# EAGLE schematic Uni-2,0,Complete (EAGLE 9.6.2)

## Sheet 1 of 4
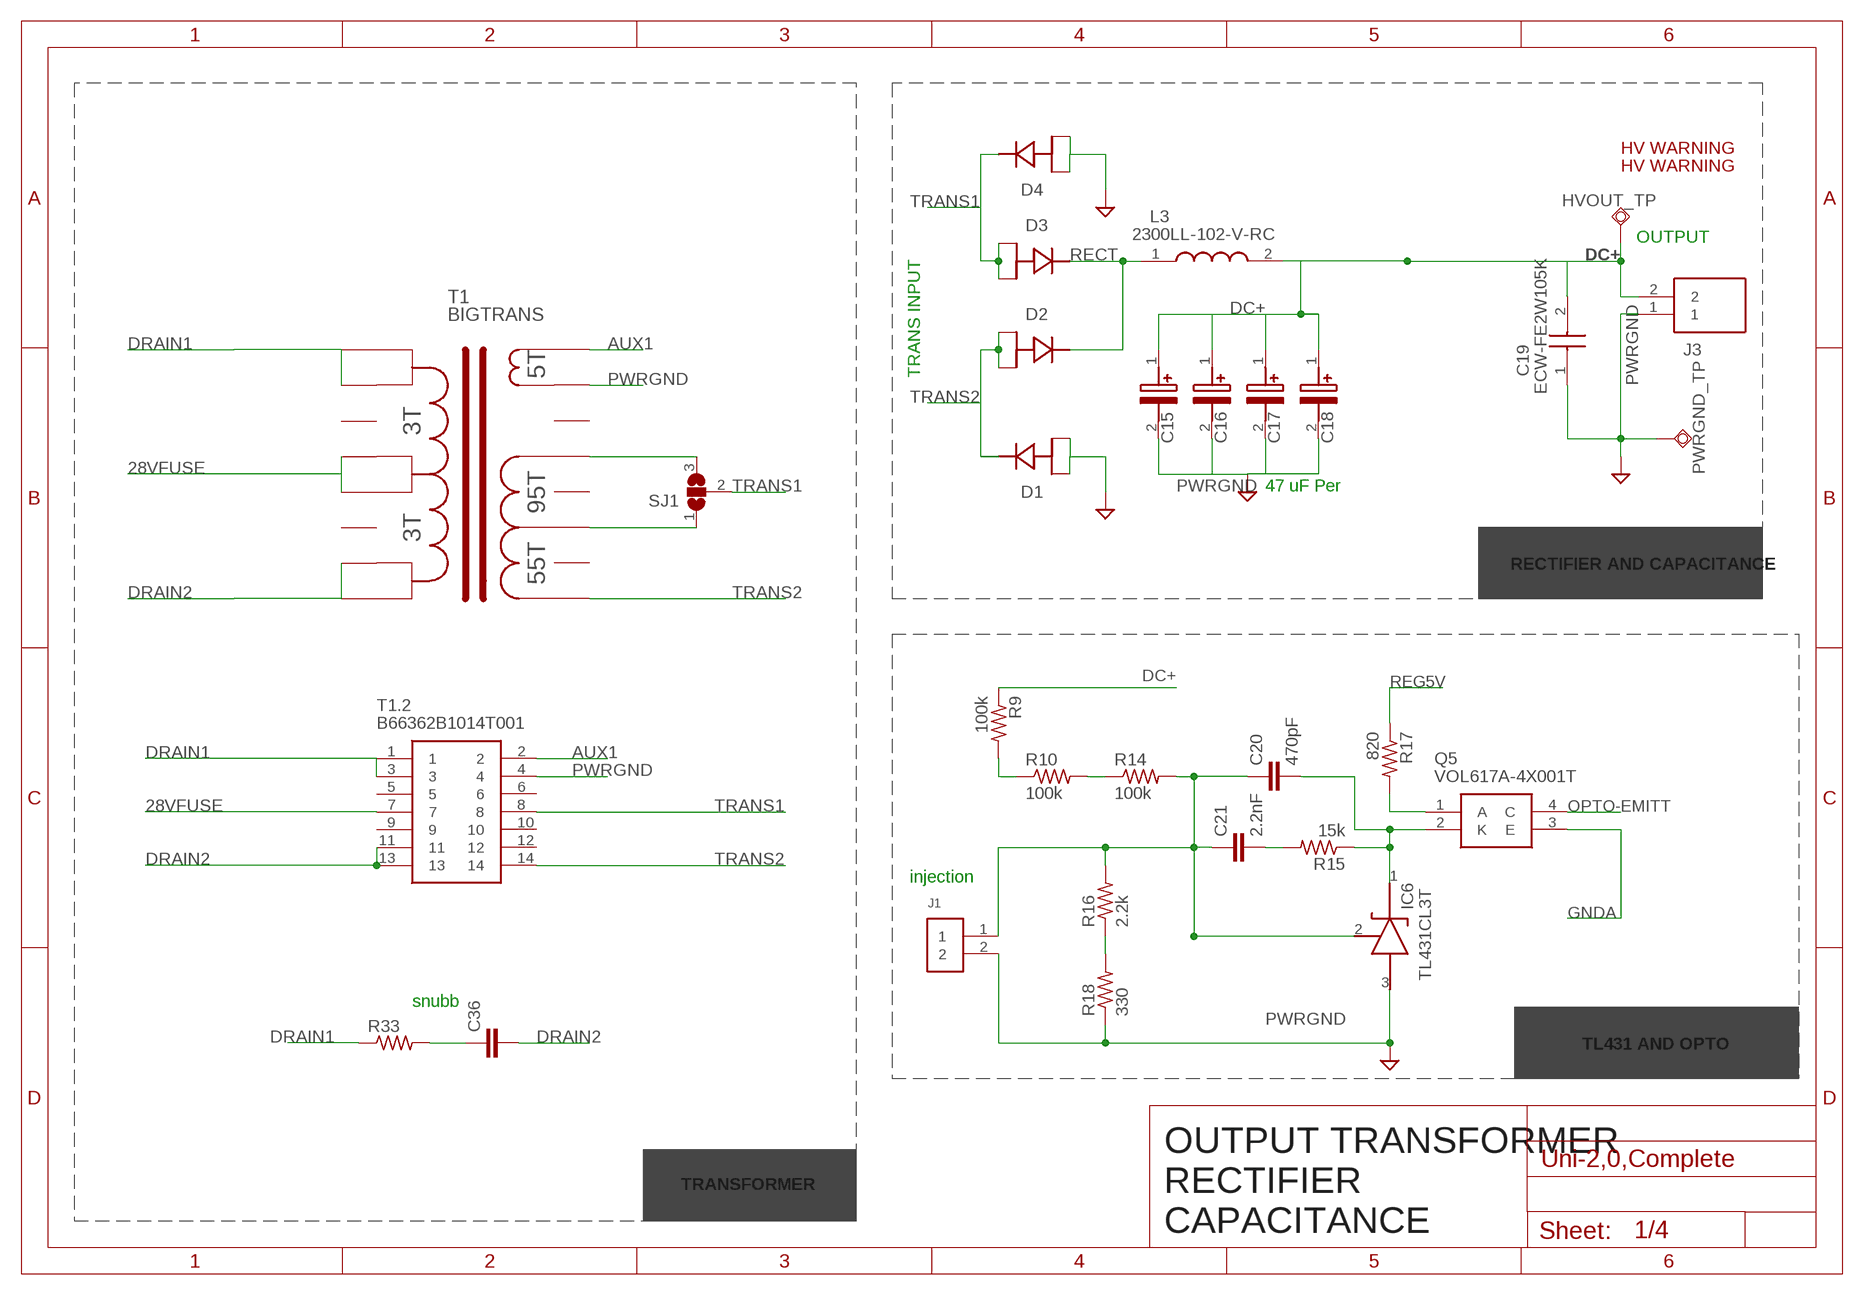
[diagram p0: schematic, sheet 1]

### Parts
C15  EEU-ED2V470S  [CAPPRD750W85D1800H2200]
C16  EEU-ED2V470S  [CAPPRD750W85D1800H2200]
C17  EEU-ED2V470S  [CAPPRD750W85D1800H2200]
C18  EEU-ED2V470S  [CAPPRD750W85D1800H2200]
C19  ECW-FE2W105K  [ECWFE2W105K]
C20  470pF  C-EUC0603K  [C0603K]
C21  2.2nF  C-EUC0603K  [C0603K]
C36  C-EUC1210K  [C1210K]
D1  FERD20H60CG-TR  [STB20N95K5]
D2  FERD20H60CG-TR  [STB20N95K5]
D3  FERD20H60CG-TR  [STB20N95K5]
D4  FERD20H60CG-TR  [STB20N95K5]
HVOUT_TP  TPSQPAD1-13  [P1-13]
IC6  TL431CL3T  [SOT95P237X112-3N]
J1  61300211121  [61300211121]
J3  TB005-762-02BE  [TB00576202BE]
L3  2300LL-102-V-RC  [2300LL102VRC]
PWRGND_TP  TPSQPAD1-13  [P1-13]
Q5  VOL617A-4X001T  [SOP254P1015X230-4N]
R9  100k  R-US_R1206  [R1206]
R10  100k  R-US_R1206  [R1206]
R14  100k  R-US_R1206  [R1206]
R15  15k  R-US_R0603  [R0603]
R16  2.2k  R-US_R0805  [R0805]
R17  820  R-US_R0603  [R0603]
R18  330  R-US_R0805  [R0805]
R33  R-US_R1206  [R1206]
SJ1  SJ2WW  [SJ_2W]
T1  BIGTRANS  [BIGTRANS!]
T1.2  B66362B1014T001  [B66362B1014T001]
U$2  HV  [PSFBC_ELECTRIC_SHOCK]
U$3  HV  [PSFBC_ELECTRIC_SHOCK]

### Nets
28VFUSE: T1.2.7 T1.4 T1.5 ; also sheet 3,4
AUX1: T1.2.2 T1.16 ; also sheet 3
DC+: C15.1(+) C16.1(+) C17.1(+) C18.1(+) C19.2 HVOUT_TP.TP J3.2 L3.2 R9.1 ; also sheet 2
DRAIN1: R33.1 T1.2.1 T1.2.3 T1.7 T1.8 ; also sheet 4
DRAIN2: C36.2 T1.1 T1.2 T1.2.11 T1.2.13 ; also sheet 4
GNDA: Q5.3(E) ; also sheet 3,4
N$1: R9.2 R10.1
N$3: C20.1 C21.1 IC6.2(REF) J1.1 R14.2 R16.2
N$9: SJ1.1 T1.11
N$15: R10.2 R14.1
N$16: R16.1 R18.2
N$18: C20.2 IC6.1(CATHODE) Q5.2(K) R15.1
N$19: Q5.1(A) R17.2
N$21: C21.2 R15.2
N$25: SJ1.3 T1.13
N$29: C36.1 R33.2
OPTO-EMITT: Q5.4(C) ; also sheet 4
PWRGND: C15.2(-) C16.2(-) C17.2(-) C18.2(-) C19.1 D1.1(A1) D1.3(A2) D4.1(A1) D4.3(A2) IC6.3(ANODE) J1.2 J3.1 PWRGND_TP.TP R18.1 T1.2.4 T1.15 ; supply symbol labelled GND ; also sheet 2,3
RECT: D2.2(K) D3.2(K) L3.1
REG5V: R17.1 ; also sheet 3
TRANS1: D3.1(A1) D3.3(A2) D4.2(K) SJ1.2 T1.2.8
TRANS2: D1.2(K) D2.1(A1) D2.3(A2) T1.2.14 T1.9
Unconnected: T1.2.5 T1.2.6 T1.2.9 T1.2.10 T1.2.12 T1.3 T1.6 T1.10 T1.12 T1.14

### Notes on the sheet
- OUTPUT
- TRANS INPUT
- 47 uF Per
- RECTIFIER AND CAPACITANCE
- injection
- snubb
- TL431 AND OPTO
- TRANSFORMER
- OUTPUT TRANSFORMER
  RECTIFIER
  CAPACITANCE

## Sheet 2 of 4
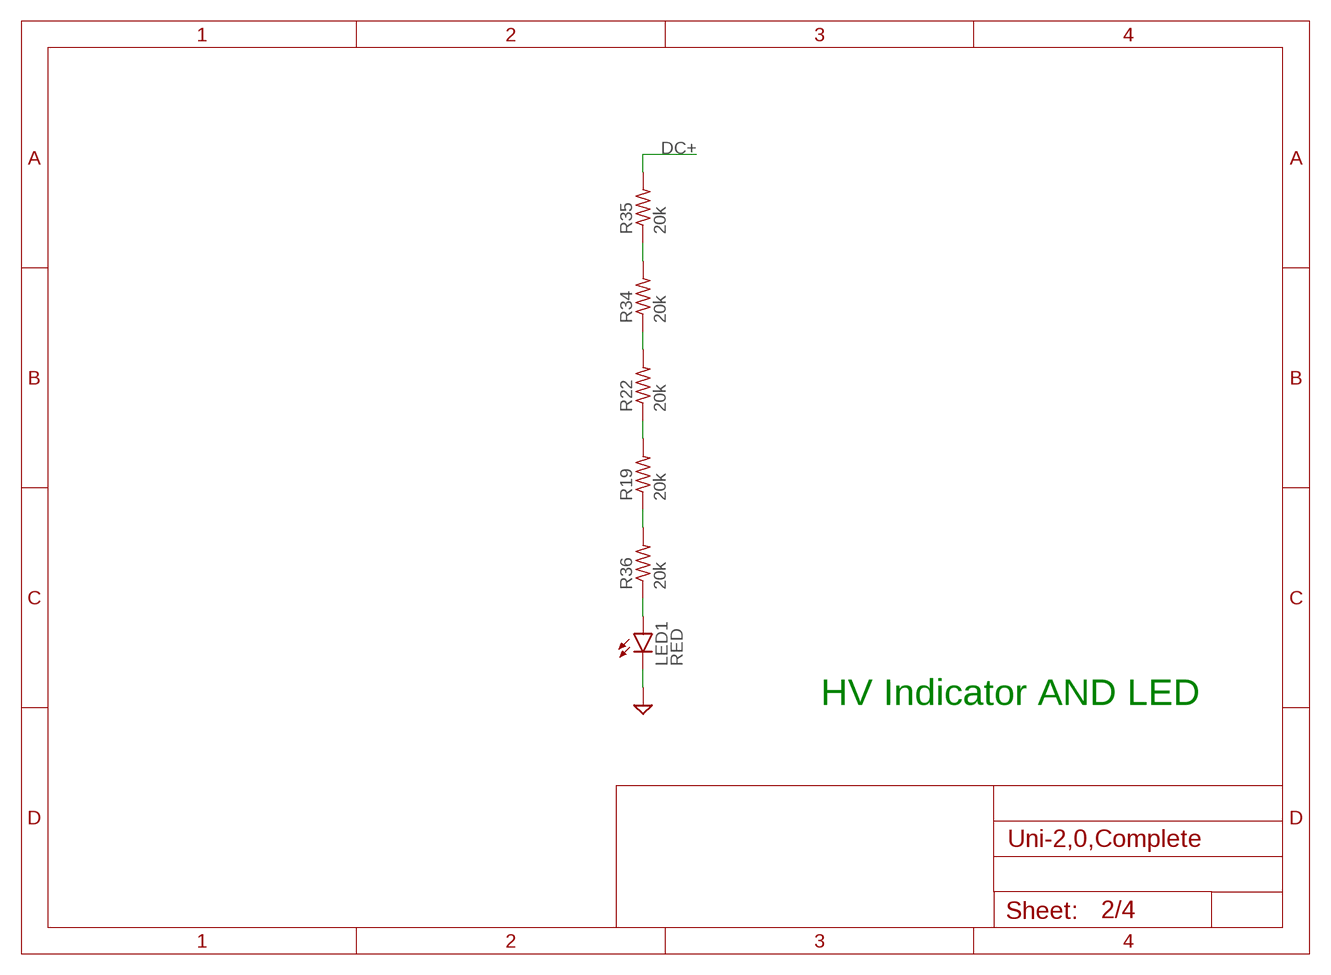
[diagram p1: schematic, sheet 2]

### Parts
LED1  RED  LEDCHIPLED_0805  [CHIPLED_0805]
R19  20k  R-US_R1206  [R1206]
R22  20k  R-US_R1206  [R1206]
R34  20k  R-US_R1206  [R1206]
R35  20k  R-US_R1206  [R1206]
R36  20k  R-US_R1206  [R1206]

### Nets
DC+: R35.2 ; also sheet 1
N$12: LED1.A R36.1
N$14: R19.1 R36.2
N$17: R19.2 R22.1
N$24: R22.2 R34.1
N$28: R34.2 R35.1
PWRGND: LED1.C ; supply symbol labelled GND ; also sheet 1,3

### Notes on the sheet
- HV Indicator AND LED

## Sheet 3 of 4
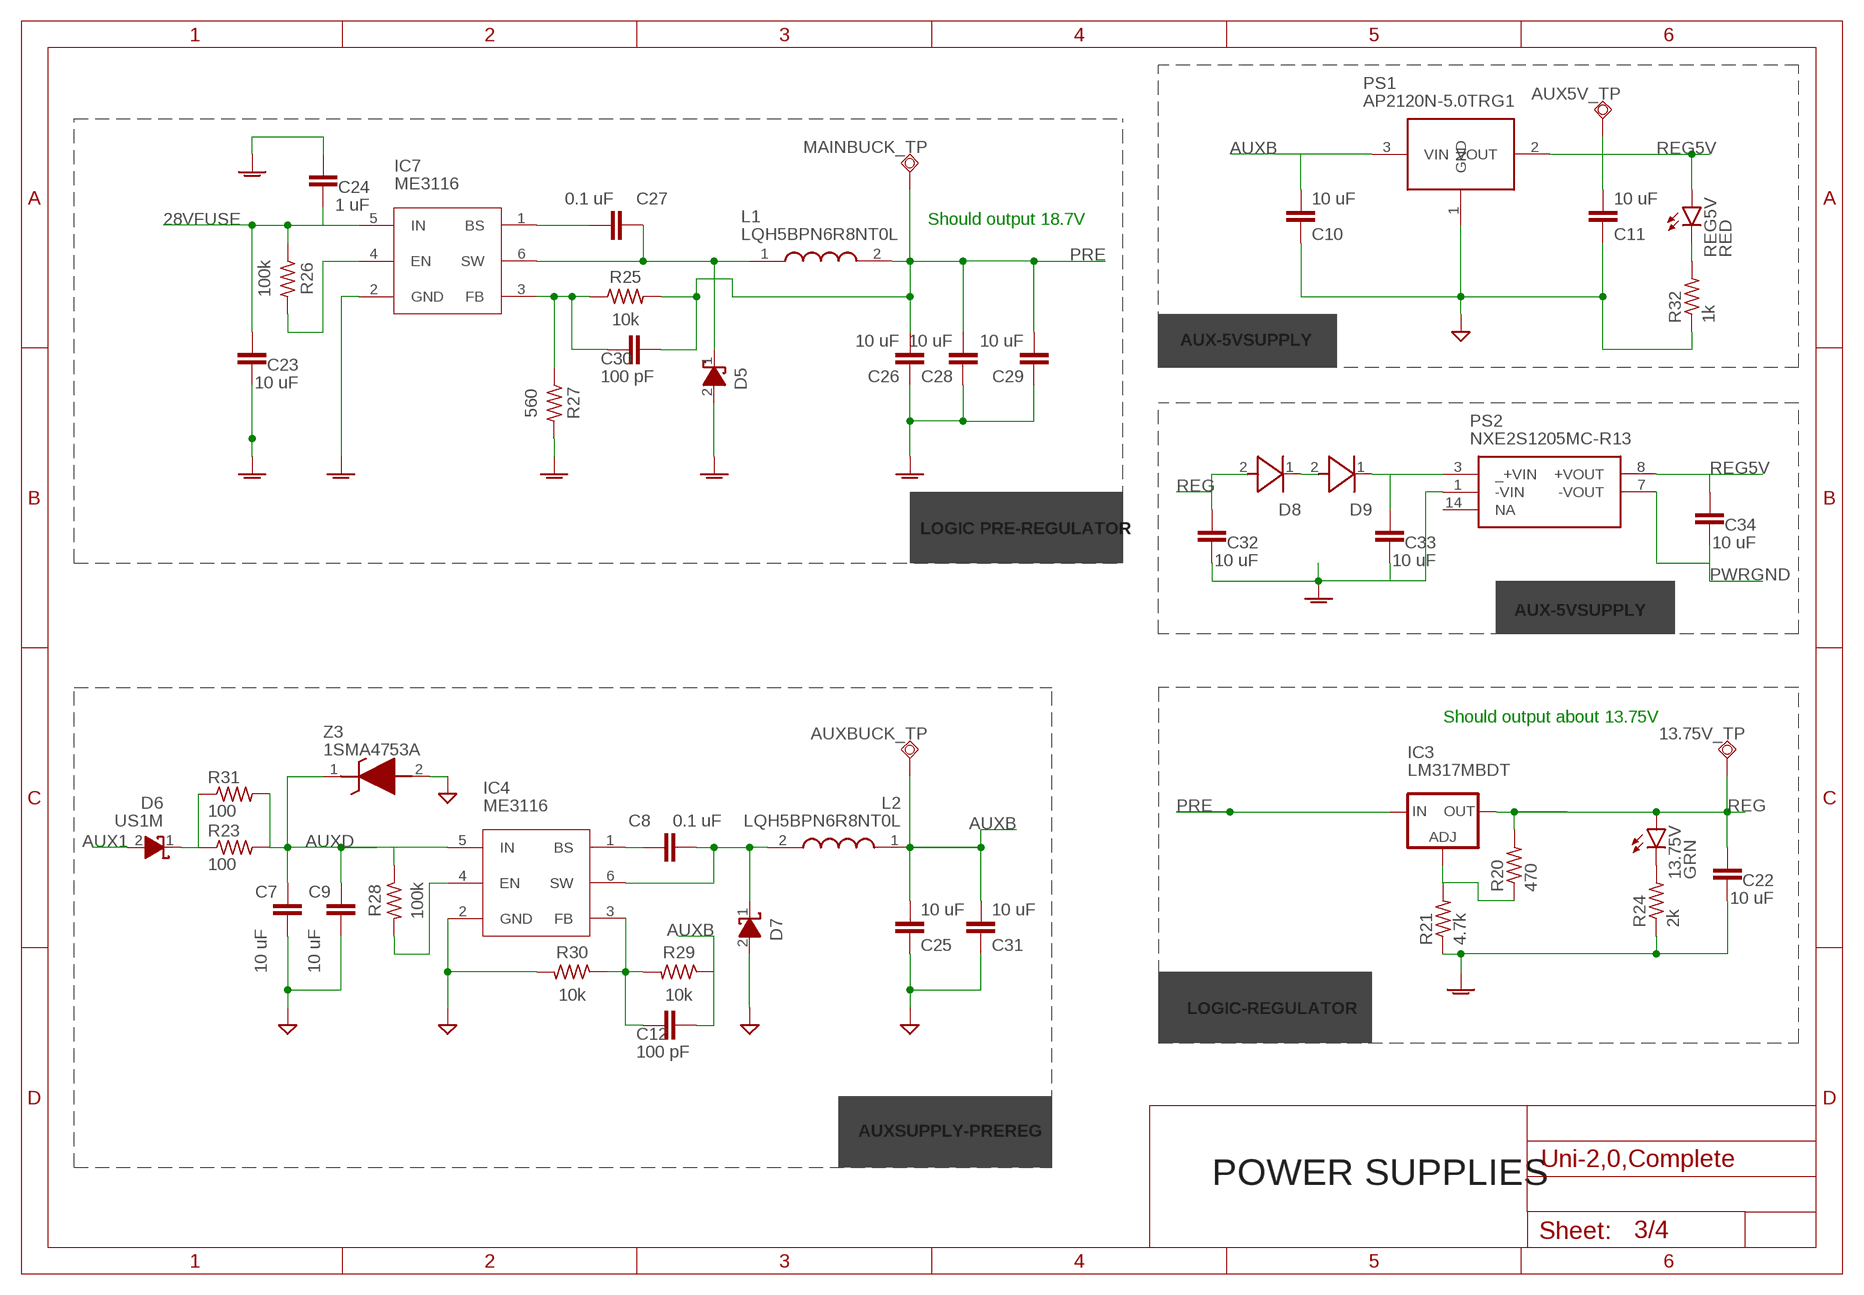
[diagram p2: schematic, sheet 3]

### Parts
13.75V  GRN  LEDCHIPLED_0805  [CHIPLED_0805]
13.75V_TP  TPSQPAD1-17  [P1-17]
AUX5V_TP  TPSQPAD1-17  [P1-17]
AUXBUCK_TP  TPSQPAD1-17  [P1-17]
C7  10 uF  C-EUC0805K  [C0805K]
C8  0.1 uF  C-EUC0603K  [C0603K]
C9  10 uF  C-EUC0805K  [C0805K]
C10  10 uF  C-EUC0603K  [C0603K]
C11  10 uF  C-EUC0603K  [C0603K]
C12  100 pF  C-EUC0402K  [C0402K]
C22  10 uF  C-EUC0805K  [C0805K]
C23  10 uF  C-EUC0805K  [C0805K]
C24  1 uF  C-EUC0603K  [C0603K]
C25  10 uF  C-EUC0603K  [C0603K]
C26  10 uF  C-EUC0805K  [C0805K]
C27  0.1 uF  C-EUC0603K  [C0603K]
C28  10 uF  C-EUC0805K  [C0805K]
C29  10 uF  C-EUC0805K  [C0805K]
C30  100 pF  C-EUC0402K  [C0402K]
C31  10 uF  C-EUC0402  [C0402]
C32  10 uF  C-EUC0805K  [C0805K]
C33  10 uF  C-EUC0603K  [C0603K]
C34  10 uF  C-EUC0603K  [C0603K]
D5  SCHOTTKY  [DIOM5127X229N]
D6  US1M  SCHOTTKY  [DIOM5127X229N]
D7  SCHOTTKY  [DIOM5127X229N]
D8  SM4007PL  1N4148W-7-F  [SOD3716X145N]
D9  SM4007PL  1N4148W-7-F  [SOD3716X145N]
IC3  LM317MBDT  [DPACK]
IC4  ME3116  [SOT95P280X100-6N]
IC7  ME3116  [SOT95P280X100-6N]
L1  LQH5BPN6R8NT0L  [LQH5BPB100MT0L]
L2  LQH5BPN6R8NT0L  [LQH5BPB100MT0L]
MAINBUCK_TP  TPSQPAD1-17  [P1-17]
PS1  AP2120N-5.0TRG1  [SOT95P240X120-3N]
PS2  NXE2S1205MC-R13  [NXE2S1205MCR13]
R20  470  R-US_R0603  [R0603]
R21  4.7k  R-US_R0603  [R0603]
R23  100  R-US_R1206  [R1206]
R24  2k  R-US_R0603  [R0603]
R25  10k  R-US_R0402  [R0402]
R26  100k  R-US_R0402  [R0402]
R27  560  R-US_R0402  [R0402]
R28  100k  R-US_R0402  [R0402]
R29  10k  R-US_R0402  [R0402]
R30  10k  R-US_R0402  [R0402]
R31  100  R-US_R1206  [R1206]
R32  1k  R-US_R0603  [R0603]
REG5V  RED  LEDCHIPLED_0805  [CHIPLED_0805]
Z3  1SMA4753A  1SMA5942BT3G  [DIOM5226X220N]

### Nets
28VFUSE: C23.2 C24.1 IC7.5(IN) R26.1 ; also sheet 1,4
AUX1: D6.2(A) ; also sheet 1
AUXB: AUXBUCK_TP.TP C10.2 C12.1 C25.2 C31.2 L2.1 PS1.3(VIN) R29.1
AUXD: C7.1 C9.1 IC4.5(IN) R23.2 R28.1 R31.2 Z3.1(K)
BS1: C27.2 IC7.1(BS)
BS2: C8.1 IC4.1(BS)
EN1: IC7.4(EN) R26.2
EN2: IC4.4(EN) R28.2
FB1: C30.2 IC7.3(FB) R25.1 R27.1
FB2: C12.2 IC4.3(FB) R29.2 R30.1
GNDA: C22.1 C23.1 C24.2 C26.1 C28.1 C29.1 C32.1 C33.1 D5.2(A) IC7.2(GND) PS2.1(-VIN) R21.1 R24.1 R27.2 ; also sheet 1,4
N$4: D8.1(K) D9.2(A)
N$10: IC3.1(ADJ) R20.1 R21.2
N$11: C33.2 D9.1(K) PS2.3(_+VIN)
N$22: 13.75V.C R24.2
N$26: R32.2 REG5V.C
N$27: D6.1(K) R23.1 R31.1
PRE: C26.2 C28.2 C29.2 C30.1 IC3.3(IN) L1.2 MAINBUCK_TP.TP R25.2
PWRGND: C7.2 C9.2 C10.1 C11.1 C25.1 C31.1 C34.1 D7.2(A) IC4.2(GND) PS1.1(GND) PS2.7(-VOUT) R30.2 R32.1 Z3.2(A) ; supply symbol labelled GND ; also sheet 1,2
REG: 13.75V.A 13.75V_TP.TP C22.2 C32.2 D8.2(A) IC3.4(OUT) R20.2 ; also sheet 4
REG5V: AUX5V_TP.TP C11.2 C34.2 PS1.2(VOUT) PS2.8(+VOUT) REG5V.A ; also sheet 1
SWITCH1: C27.1 D5.1(K) IC7.6(SW) L1.1
SWITCH2: C8.2 D7.1(K) IC4.6(SW) L2.2
Unconnected: PS2.14(NA)

### Notes on the sheet
- Should output 18.7V
- AUX-5VSUPPLY
- LOGIC PRE-REGULATOR
- AUX-5VSUPPLY
- Should output about 13.75V
- LOGIC-REGULATOR
- AUXSUPPLY-PREREG
- POWER SUPPLIES

## Sheet 4 of 4
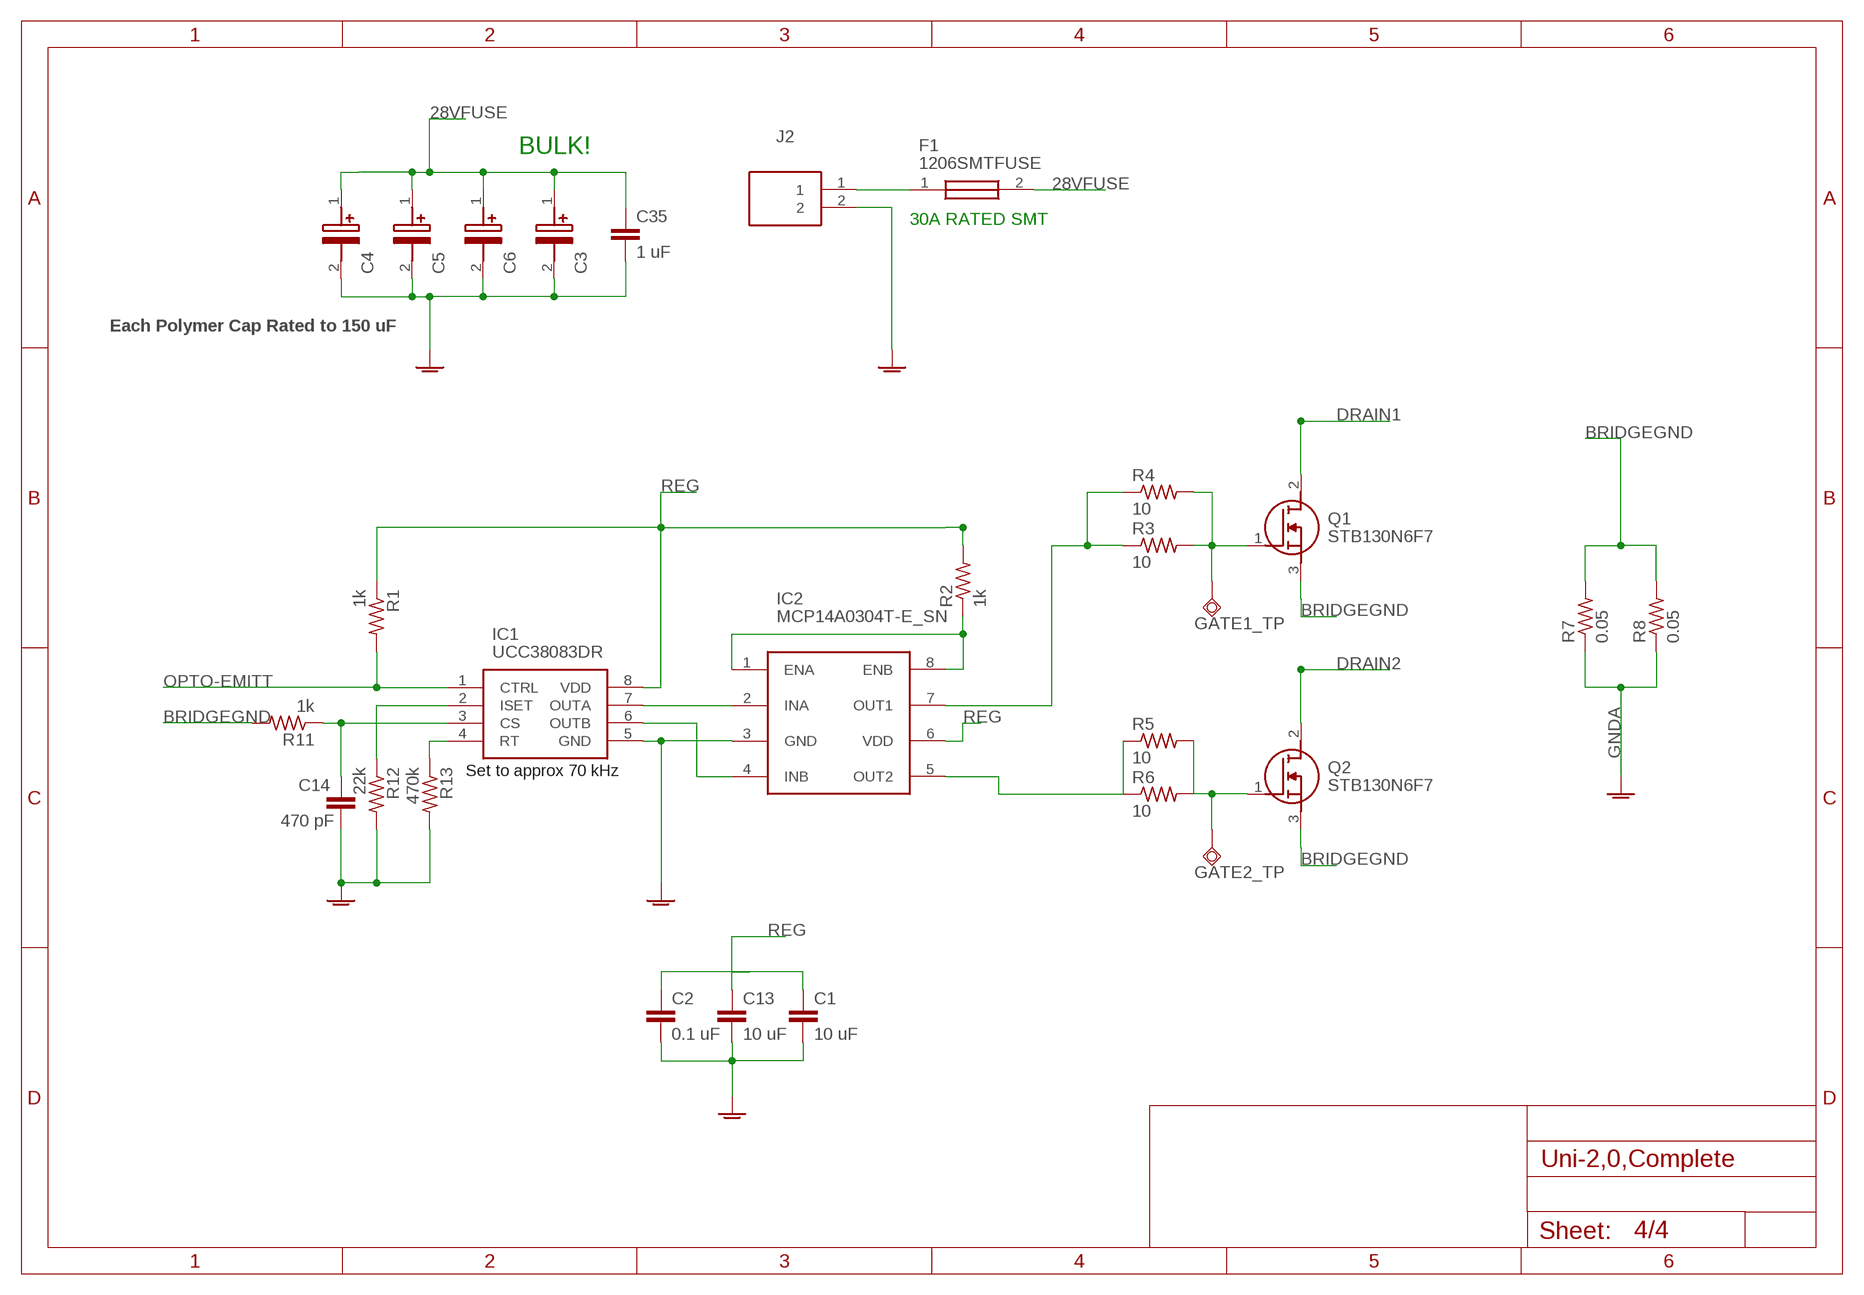
[diagram p3: schematic, sheet 4]

### Parts
C1  10 uF  C-EUC0603K  [C0603K]
C2  0.1 uF  C-EUC0603K  [C0603K]
C3  OVK151M1VTR-10131  [16SVF1000M]
C4  OVK151M1VTR-10131  [16SVF1000M]
C5  OVK151M1VTR-10131  [16SVF1000M]
C6  OVK151M1VTR-10131  [16SVF1000M]
C13  10 uF  C-EUC0603K  [C0603K]
C14  470 pF  C-EUC0603K  [C0603K]
C35  1 uF  C-EUC0805K  [C0805K]
F1  1206SMTFUSE  [1206SMTFUSE]
GATE1_TP  TPSQPAD1-17  [P1-17]
GATE2_TP  TPSQPAD1-17  [P1-17]
IC1  UCC38083DR  [SOIC127P600X175-8N]
IC2  MCP14A0304T-E_SN  [SOIC127P600X175-8N]
J2  TB005-762-02BE  [TB00576202BE]
Q1  STB130N6F7  [D2PAK]
Q2  STB130N6F7  [D2PAK]
R1  1k  R-US_R0603  [R0603]
R2  1k  R-US_R0402  [R0402]
R3  10  R-US_R0805  [R0805]
R4  10  R-US_R0805  [R0805]
R5  10  R-US_R0805  [R0805]
R6  10  R-US_R0805  [R0805]
R7  0.05  R-US_R2512  [R2512]
R8  0.05  R-US_R2512  [R2512]
R11  1k  R-US_R0603  [R0603]
R12  22k  R-US_R0603  [R0603]
R13  470k  R-US_R0603  [R0603]
U$1  HV  [PSFBC_ELECTRIC_SHOCK]  (not placed on a sheet)

### Nets
28VFUSE: C3.1(+) C4.1(+) C5.1(+) C6.1(+) C35.1 F1.2 ; also sheet 1,3
BRIDGEGND: Q1.3(S) Q2.3(S) R7.2 R8.2 R11.2
CS-IN: C14.1 IC1.3(CS) R11.1
DRAIN1: Q1.2(D) ; also sheet 1
DRAIN2: Q2.2(D) ; also sheet 1
GNDA: C1.2 C2.2 C3.2(-) C4.2(-) C5.2(-) C6.2(-) C13.2 C14.2 C35.2 IC1.5(GND) IC2.3(GND) J2.2 R7.1 R8.1 R12.2 R13.2 ; also sheet 1,3
N$2: IC1.7(OUTA) IC2.2(INA)
N$5: IC1.6(OUTB) IC2.4(INB)
N$6: IC2.1(ENA) IC2.8(ENB) R2.1
N$7: IC2.7(OUT1) R3.1 R4.1
N$8: IC2.5(OUT2) R5.1 R6.1
N$13: IC1.2(ISET) R12.1
N$20: F1.1 J2.1
OPTO-EMITT: IC1.1(CTRL) R1.2 ; also sheet 1
Q1G: GATE1_TP.TP Q1.1(G) R3.2 R4.2
Q2G: GATE2_TP.TP Q2.1(G) R5.2 R6.2
REG: C1.1 C2.1 C13.1 IC1.8(VDD) IC2.6(VDD) R1.1 R2.2 ; also sheet 3
RT: IC1.4(RT) R13.1

### Notes on the sheet
- BULK!
- 30A RATED SMT
- Each Polymer Cap Rated to 150 uF
- Set to approx 70 kHz

## Library data of the parts
13.75V REG5V = led:LED: LED OSRAM: - CHIPLED LG R971, LG N971, LY N971, LG Q971, LY Q971, LO R971, LY R971 LH N974, LH R974 LS Q976, LO Q976, LY Q976 LO Q996 - Hyper CHIPLED LW Q18S LB Q993, LB Q99A, LB R99A - SideLED LS A670, LO A670, LY A670, LG A670, LP A670 LB A673, LV A673, LT A673, LW A673 LH A674 LY A675 LS A676, LA A676, LO A676, LY A676, LW A676 LS A679, LY A679, LG A679 - Hyper Micro SIDELED® LS Y876, LA Y876, LO Y876, LY Y876 LT Y87S - SmartLED LW L88C, LW L88S LB L89C, LB L89S, LG L890 LS L89K, LO L89K, LY L89K LS L896, LA L896, LO L896, LY L896 - TOPLED LS T670, LO T670, LY T670, LG T670, LP T670 LSG T670, LSP T670, LSY T670, LOP T670, LYG T670 LG T671, LOG T671, LSG T671 LB T673, LV T673, LT T673, LW T673 LH T674 LS T676, LA T676, LO T676, LY T676, LB T676, LH T676, LSB T676, LW T676 LB T67C, LV T67C, LT T67C, LS T67K, LO T67K, LY T67K, LW E67C LS E67B, LA E67B, LO E67B, LY E67B, LB E67C, LV E67C, LT E67C LW T67C LS T679, LY T679, LG T679 LS T770, LO T770, LY T770, LG T770, LP T770 LB T773, LV T773, LT T773, LW T773 LH T774 LS E675, LA E675, LY E675, LS T675 LS T776, LA T776, LO T776, LY T776, LB T776 LHGB T686 LT T68C, LB T68C - Hyper Mini TOPLED® LB M676 - Mini TOPLED Santana® LG M470 LS M47K, LO M47K, LY M47K Source: http://www.osram.convergy.de LUXEON: - LUMILED® LXK2-PW12-R00, LXK2-PW12-S00, LXK2-PW14-U00, LXK2-PW14-V00 LXK2-PM12-R00, LXK2-PM12-S00, LXK2-PM14-U00 LXK2-PE12-Q00, LXK2-PE12-R00, LXK2-PE12-S00, LXK2-PE14-T00, LXK2-PE14-U00 LXK2-PB12-K00, LXK2-PB12-L00, LXK2-PB12-M00, LXK2-PB14-N00, LXK2-PB14-P00, LXK2-PB14-Q00 LXK2-PR12-L00, LXK2-PR12-M00, LXK2-PR14-Q00, LXK2-PR14-R00 LXK2-PD12-Q00, LXK2-PD12-R00, LXK2-PD12-S00 LXK2-PH12-R00, LXK2-PH12-S00 LXK2-PL12-P00, LXK2-PL12-Q00, LXK2-PL12-R00 Source: www.luxeon.com KINGBRIGHT: KA-3528ASYC Source: www.kingbright.com; LCSC_PART: C72043
13.75V_TP AUX5V_TP AUXBUCK_TP GATE1_TP GATE2_TP HVOUT_TP MAINBUCK_TP PWRGND_TP = testpad:TPSQ: Test pad
C1 C2 C10 C13 C24 C25 C31 C33-C35 = rcl:C-EU: CAPACITOR, European symbol; LCSC_PART: C440198; SPICEPREFIX: C
C3-C6 = SamacSys_Parts:OVK151M1VTR-1013: OVK151M1VTR-1013
C7 C9 C11 C20 C21 C36 = rcl:C-EU: CAPACITOR, European symbol; SPICEPREFIX: C
C8 C27 = rcl:C-EU: CAPACITOR, European symbol; LCSC_PART: C14663; SPICEPREFIX: C
C12 C30 = rcl:C-EU: CAPACITOR, European symbol; LCSC_PART: C1546; SPICEPREFIX: C
C14 = rcl:C-EU: CAPACITOR, European symbol; LCSC_PART: C1620; SPICEPREFIX: C
C15-C18 = SamacSys_Parts:EEU-ED2V470S: Aluminium Electrolytic Capacitor, Radial Lead Source: Datasheet <http://industrial.panasonic.com/cdbs/www-data/pdf/RDF0000/ABA0000C1258.pdf>; DESCRIPTION: Aluminium Electrolytic Capacitor, Radial Lead; HEIGHT: 22mm; MANUFACTURER_NAME: Panasonic; MANUFACTURER_PART_NUMBER: EEU-ED2V470S; MOUSER_PART_NUMBER: 667-EEU-ED2V470S; MOUSER_PRICE-STOCK: https://www.mouser.co.uk/ProductDetail/Panasonic/EEU-ED2V470S?qs=MtOUKumLmnbbtLZIfgoN%2Fg%3D%3D
C19 = SamacSys_Parts:ECW-FE2W105K: Film Capacitors 450VDC 1.0uF 10% MPP L/S=15mm Source: Datasheet <https://www.mouser.fr/datasheet/2/315/panasonic_06262019_Capacitor_Film_Leaded_(ECW-F(E)-1609057.pdf>; DESCRIPTION: Film Capacitors 450VDC 1.0uF 10% MPP L/S=15mm; HEIGHT: 13mm; MANUFACTURER_NAME: Panasonic; MANUFACTURER_PART_NUMBER: ECW-FE2W105K
C22 C23 C26 C28 C29 C32 = rcl:C-EU: CAPACITOR, European symbol; LCSC_PART: C440198
D1-D4 = SamacSys_Parts:FERD20H60CG-TR: Rectifiers Field-Effect Rectifier Diode 60V Source: Datasheet <https://www.st.com/resource/en/datasheet/ferd20h60c.pdf>; DESCRIPTION: Rectifiers Field-Effect Rectifier Diode 60V; HEIGHT: 4mm; MANUFACTURER_NAME: STMicroelectronics; MANUFACTURER_PART_NUMBER: FERD20H60CG-TR; MOUSER_PART_NUMBER: 511-FERD20H60CG-TR; MOUSER_PRICE-STOCK: https://www.mouser.co.uk/ProductDetail/STMicroelectronics/FERD20H60CG-TR?qs=1mbolxNpo8ebHpKodyoUCQ%3D%3D
D5 D7 = SamacSys_Parts:SCHOTTKY: Schottky Diodes & Rectifiers 60V Sctky Bar Rectfr SMA (DO-214AC) Source: Datasheet <https://www.arrow.com/en/products/ss16he3-bh/vishay>; DESCRIPTION: Schottky Diodes & Rectifiers 60V Sctky Bar Rectfr SMA (DO-214AC); HEIGHT: 2.29mm; LCSC_PART: C22452; MANUFACTURER_NAME: Vishay; MANUFACTURER_PART_NUMBER: SS16HE3_B/H; MOUSER_PART_NUMBER: 78-SS16HE3_B/H; MOUSER_PRICE-STOCK: https://www.mouser.co.uk/ProductDetail/Vishay-General-Semiconductor/SS16HE3_B-H?qs=MLItCLRbWsyJmaJ87KUvIw%3D%3D
D6 = SamacSys_Parts:SCHOTTKY: Schottky Diodes & Rectifiers 60V Sctky Bar Rectfr SMA (DO-214AC) Source: Datasheet <https://www.arrow.com/en/products/ss16he3-bh/vishay>; DESCRIPTION: Schottky Diodes & Rectifiers 60V Sctky Bar Rectfr SMA (DO-214AC); HEIGHT: 2.29mm; MANUFACTURER_NAME: Vishay; MANUFACTURER_PART_NUMBER: SS16HE3_B/H; MOUSER_PART_NUMBER: 78-SS16HE3_B/H; MOUSER_PRICE-STOCK: https://www.mouser.co.uk/ProductDetail/Vishay-General-Semiconductor/SS16HE3_B-H?qs=MLItCLRbWsyJmaJ87KUvIw%3D%3D
D8 D9 = SamacSys_Parts:1N4148W-7-F: Diode Switching 150mA 100V 400mW SOD123 Diodes Inc 1N4148W-7-F Switching Diode 100V, 2-Pin SOD-123 Source: Datasheet <https://componentsearchengine.com/Datasheets/2/1N4148W-7-F.pdf>; DESCRIPTION: Diode Switching 150mA 100V 400mW SOD123 Diodes Inc 1N4148W-7-F Switching Diode 100V, 2-Pin SOD-123; HEIGHT: 1.45mm; LCSC_PART: C64898; MANUFACTURER_NAME: Diodes Inc.; MANUFACTURER_PART_NUMBER: 1N4148W-7-F; MOUSER_PART_NUMBER: 621-1N4148W-F; MOUSER_PRICE-STOCK: https://www.mouser.co.uk/ProductDetail/Diodes-Incorporated/1N4148W-7-F?qs=LHX0FizJzg7Ae9ZM8LTAWw%3D%3D
F1 = SamacSys_Parts:1206SMTFUSE: Surface Mount Fuses Surface Mt Chip fuse 1206 size, 40A Source: Datasheet <https://www.belfuse.com/resources/datasheets/circuitprotection/ds-cp-0685p-series.pdf>; DESCRIPTION: Surface Mount Fuses Surface Mt Chip fuse 1206 size, 40A; HEIGHT: 0.83mm; MANUFACTURER_NAME: Stewart Connector; MANUFACTURER_PART_NUMBER: 0685P9400-01; MOUSER_PART_NUMBER: 530-0685P9400-01; MOUSER_PRICE-STOCK: https://www.mouser.co.uk/ProductDetail/Bel-Fuse/0685P9400-01?qs=vLWxofP3U2w%252BWbEEn77VXg%3D%3D
IC1 = SamacSys_Parts:UCC38083DR: Current Mode Push-Pull PWM With Programmable Slope Compensation Source: Datasheet <http://www.ti.com/lit/gpn/ucc38083>; DESCRIPTION: Current Mode Push-Pull PWM With Programmable Slope Compensation; HEIGHT: 1.75mm; MANUFACTURER_NAME: Texas Instruments; MANUFACTURER_PART_NUMBER: UCC38083DR; MOUSER_PART_NUMBER: 595-UCC38083DR; MOUSER_PRICE-STOCK: https://www.mouser.co.uk/ProductDetail/Texas-Instruments/UCC38083DR/?qs=zqbRmZ%252BfZD9Rvt3ie7yhvg%3D%3D
IC2 = SamacSys_Parts:MCP14A0304T-E_SN: Microchip Technology MCP14A0304T-E/SN Dual Low Side MOSFET Power Driver, 3A 8-Pin, SOIC Source: Datasheet <http://www.microchip.com/mymicrochip/filehandler.aspx?ddocname=en606629>; DESCRIPTION: Microchip Technology MCP14A0304T-E/SN Dual Low Side MOSFET Power Driver, 3A 8-Pin, SOIC; HEIGHT: 1.75mm; MANUFACTURER_NAME: Microchip; MANUFACTURER_PART_NUMBER: MCP14A0304T-E/SN; MOUSER_PART_NUMBER: 579-MCP14A0304T-E/SN; MOUSER_PRICE-STOCK: https://www.mouser.co.uk/ProductDetail/Microchip-Technology/MCP14A0304T-E-SN?qs=w%2Fv1CP2dgqqqWUCaoFqV0w%3D%3D
IC3 = v-reg:LM317?*: 500 mA Adjustable Output Positive Voltage Regulator Source: http://www.onsemi.co.jp .. LM317M-D.PDF
IC4 IC7 = SamacSys_Parts:ME3116; LCSC_PART: C97643
IC6 = SamacSys_Parts:TL431CL3T: Adjustable micropower shunt voltage reference Source: Datasheet <https://www.st.com/resource/en/datasheet/tl431.pdf>; DESCRIPTION: Adjustable micropower shunt voltage reference; HEIGHT: 1.12mm; MANUFACTURER_NAME: STMicroelectronics; MANUFACTURER_PART_NUMBER: TL431CL3T; MOUSER_PART_NUMBER: 511-TL431CL3T; MOUSER_PRICE-STOCK: https://www.mouser.co.uk/ProductDetail/STMicroelectronics/TL431CL3T?qs=L6eUzyzWLAsU2SYO1NdhdA%3D%3D
J1 = Headers:61300211121: CONN HEADER VERT 2POS 2.54MM Manufacturer's datasheet <https://katalog.we-online.de/em/datasheet/6130xx11121.pdf>; CREATED_BY: PCBLayout.com; DIGI_KEY_PART_NUMBER: 732-5315-ND; MANUFACTURER: Wurth Electronics Inc.; MPN: 61300211121
J2 J3 = SamacSys_Parts:TB005-762-02BE: Fixed Terminal Blocks screw type, 7.62 , horizontal, 2 poles, CUI Blue, slotted screw, PCB mount Source: Datasheet <https://componentsearchengine.com/Datasheets/1/TB005-762-02BE.pdf>; DESCRIPTION: Fixed Terminal Blocks screw type, 7.62 , horizontal, 2 poles, CUI Blue, slotted screw, PCB mount; HEIGHT: 21.7mm; MANUFACTURER_NAME: CUI Inc.; MANUFACTURER_PART_NUMBER: TB005-762-02BE; MOUSER_PART_NUMBER: 490-TB005-762-02BE; MOUSER_PRICE-STOCK: https://www.mouser.co.uk/ProductDetail/CUI-Devices/TB005-762-02BE?qs=vLWxofP3U2zXv1H2wuShow%3D%3D
L1 L2 = SamacSys_Parts:LQH5BPN6R8NT0L: MURATA - LQH5BPN6R8NT0L - INDUCTOR, 6.8UH, +/-30%, POWER Source: Datasheet <https://psearch.en.murata.com/inductor/product/LQH5BPN6R8NT0#.html>; DESCRIPTION: MURATA - LQH5BPN6R8NT0L - INDUCTOR, 6.8UH, +/-30%, POWER; HEIGHT: 2.2mm; MANUFACTURER_NAME: Murata Electronics; MANUFACTURER_PART_NUMBER: LQH5BPN6R8NT0L; MOUSER_PART_NUMBER: 81-LQH5BPN6R8NT0L0L; MOUSER_PRICE-STOCK: https://www.mouser.co.uk/ProductDetail/Murata-Electronics/LQH5BPN6R8NT0L?qs=3ZwS9AhGA%2F4N8axqd87eRQ%3D%3D
L3 = SamacSys_Parts:2300LL-102-V-RC: Inductor High Current Toroid 1000uH/378.9uH 15% 1KHz 3.5A 137mOhm DCR RDL Source: Datasheet; DESCRIPTION: Inductor High Current Toroid 1000uH/378.9uH 15% 1KHz 3.5A 137mOhm DCR RDL; HEIGHT: 32.512mm; MANUFACTURER_NAME: Bourns; MANUFACTURER_PART_NUMBER: 2300LL-102-V-RC; MOUSER_PART_NUMBER: 652-2300LL-102-V-RC; MOUSER_PRICE-STOCK: https://www.mouser.co.uk/ProductDetail/Bourns/2300LL-102-V-RC?qs=d7g9p1yFhWZHzfawXthNnQ%3D%3D
LED1 = led:LED: LED OSRAM: - CHIPLED LG R971, LG N971, LY N971, LG Q971, LY Q971, LO R971, LY R971 LH N974, LH R974 LS Q976, LO Q976, LY Q976 LO Q996 - Hyper CHIPLED LW Q18S LB Q993, LB Q99A, LB R99A - SideLED LS A670, LO A670, LY A670, LG A670, LP A670 LB A673, LV A673, LT A673, LW A673 LH A674 LY A675 LS A676, LA A676, LO A676, LY A676, LW A676 LS A679, LY A679, LG A679 - Hyper Micro SIDELED® LS Y876, LA Y876, LO Y876, LY Y876 LT Y87S - SmartLED LW L88C, LW L88S LB L89C, LB L89S, LG L890 LS L89K, LO L89K, LY L89K LS L896, LA L896, LO L896, LY L896 - TOPLED LS T670, LO T670, LY T670, LG T670, LP T670 LSG T670, LSP T670, LSY T670, LOP T670, LYG T670 LG T671, LOG T671, LSG T671 LB T673, LV T673, LT T673, LW T673 LH T674 LS T676, LA T676, LO T676, LY T676, LB T676, LH T676, LSB T676, LW T676 LB T67C, LV T67C, LT T67C, LS T67K, LO T67K, LY T67K, LW E67C LS E67B, LA E67B, LO E67B, LY E67B, LB E67C, LV E67C, LT E67C LW T67C LS T679, LY T679, LG T679 LS T770, LO T770, LY T770, LG T770, LP T770 LB T773, LV T773, LT T773, LW T773 LH T774 LS E675, LA E675, LY E675, LS T675 LS T776, LA T776, LO T776, LY T776, LB T776 LHGB T686 LT T68C, LB T68C - Hyper Mini TOPLED® LB M676 - Mini TOPLED Santana® LG M470 LS M47K, LO M47K, LY M47K Source: http://www.osram.convergy.de LUXEON: - LUMILED® LXK2-PW12-R00, LXK2-PW12-S00, LXK2-PW14-U00, LXK2-PW14-V00 LXK2-PM12-R00, LXK2-PM12-S00, LXK2-PM14-U00 LXK2-PE12-Q00, LXK2-PE12-R00, LXK2-PE12-S00, LXK2-PE14-T00, LXK2-PE14-U00 LXK2-PB12-K00, LXK2-PB12-L00, LXK2-PB12-M00, LXK2-PB14-N00, LXK2-PB14-P00, LXK2-PB14-Q00 LXK2-PR12-L00, LXK2-PR12-M00, LXK2-PR14-Q00, LXK2-PR14-R00 LXK2-PD12-Q00, LXK2-PD12-R00, LXK2-PD12-S00 LXK2-PH12-R00, LXK2-PH12-S00 LXK2-PL12-P00, LXK2-PL12-Q00, LXK2-PL12-R00 Source: www.luxeon.com KINGBRIGHT: KA-3528ASYC Source: www.kingbright.com
PS1 = SamacSys_Parts:AP2120N-5.0TRG1: IC REG LINEAR 5V 150MA SOT23 Source: Datasheet; DESCRIPTION: IC REG LINEAR 5V 150MA SOT23; HEIGHT: 1.2mm; MANUFACTURER_NAME: Diodes Inc.; MANUFACTURER_PART_NUMBER: AP2120N-5.0TRG1; MOUSER_PART_NUMBER: 621-AP2120N-5.0TRG1; MOUSER_PRICE-STOCK: https://www.mouser.co.uk/ProductDetail/Diodes-Incorporated/AP2120N-50TRG1?qs=M%2FOdCRO8QQ3JQu49DdtyIA%3D%3D
PS2 = SamacSys_Parts:NXE2S1205MC-R13: Isolated DC/DC Converters DC/DC SM 2W 12-5V Single 3kV Source: Datasheet; DESCRIPTION: Isolated DC/DC Converters DC/DC SM 2W 12-5V Single 3kV; HEIGHT: 4.81mm; MANUFACTURER_NAME: Murata Electronics; MANUFACTURER_PART_NUMBER: NXE2S1205MC-R13; MOUSER_PART_NUMBER: 580-NXE2S1205MC-R13; MOUSER_PRICE-STOCK: https://www.mouser.co.uk/ProductDetail/Murata-Power-Solutions/NXE2S1205MC-R13?qs=UqPySVGgRwFuSegQbHt7Hw%3D%3D
Q1 Q2 = SamacSys_Parts:STB130N6F7
Q5 = SamacSys_Parts:VOL617A-4X001T: Vishay VOL617A-4X001T DC Input Phototransistor Output Optocoupler, Surface Mount, 4-Pin LSOP Source: Datasheet <https://www.vishay.com/docs/82424/vol617a.pdf>; DESCRIPTION: Vishay VOL617A-4X001T DC Input Phototransistor Output Optocoupler, Surface Mount, 4-Pin LSOP; HEIGHT: 2.3mm; MANUFACTURER_NAME: Vishay; MANUFACTURER_PART_NUMBER: VOL617A-4X001T; MOUSER_PART_NUMBER: 78-VOL617A-4X001T; MOUSER_PRICE-STOCK: https://www.mouser.co.uk/ProductDetail/Vishay-Semiconductors/VOL617A-4X001T?qs=s4XK1XdnRilEoTFGQUoymA%3D%3D
R1 R20 R21 R24 R32 = rcl:R-US_: RESISTOR, American symbol; LCSC_PART: C22975; SPICEPREFIX: R
R2-R10 R14-R19 R22 R23 R31 R33-R36 = rcl:R-US_: RESISTOR, American symbol; SPICEPREFIX: R
R11 = rcl:R-US_: RESISTOR, American symbol; LCSC_PART: C21190; SPICEPREFIX: R
R12 = rcl:R-US_: RESISTOR, American symbol; LCSC_PART: C31850; SPICEPREFIX: R
R13 = rcl:R-US_: RESISTOR, American symbol; LCSC_PART: C25811; SPICEPREFIX: R
R25 R29 R30 = rcl:R-US_: RESISTOR, American symbol; LCSC_PART: C25779; SPICEPREFIX: R
R26 R28 = rcl:R-US_: RESISTOR, American symbol; LCSC_PART: C25741; SPICEPREFIX: R
R27 = rcl:R-US_: RESISTOR, American symbol; LCSC_PART: C4177; SPICEPREFIX: R
SJ1 = jumper:SJ2W: SMD solder JUMPER
T1 = SamacSys_Parts:BIGTRANS
T1.2 = SamacSys_Parts:B66362B1014T001: Ferrite Accessories, E Cores Accessories(EFD/ER/ETD), Coil former (ETD 34/17/11) Source: Datasheet <https://product.tdk.com/system/files/dam/doc/product/ferrite/ferrite/ferrite-acc/data_sheet/80/db/fer/etd_34_17_11.pdf>; DESCRIPTION: Ferrite Accessories, E Cores Accessories(EFD/ER/ETD), Coil former (ETD 34/17/11); HEIGHT: 33.1mm; MANUFACTURER_NAME: TDK; MANUFACTURER_PART_NUMBER: B66362B1014T001; MOUSER_PART_NUMBER: 871-B66362B1014T001; MOUSER_PRICE-STOCK: https://www.mouser.co.uk/ProductDetail/EPCOS-TDK/B66362B1014T001?qs=w5o0Loj0u7M9FVK%2Ff7P38g%3D%3D
U$1-U$3 = RMP - HALF BRIDGE 0.0.1:HV
Z3 = SamacSys_Parts:1SMA5942BT3G: ON Semiconductor 1SMA5942BT3G Zener Diode, 51V 5% 1.5 W SMT 2-Pin SMA Source: Datasheet <http://www.onsemi.com/pub/Collateral/1SMA5913BT3-D.PDF>; DESCRIPTION: ON Semiconductor 1SMA5942BT3G Zener Diode, 51V 5% 1.5 W SMT 2-Pin SMA; HEIGHT: 2.2mm; LCSC_PART: C362284; MANUFACTURER_NAME: onsemi; MANUFACTURER_PART_NUMBER: 1SMA5942BT3G; MOUSER_PART_NUMBER: 863-1SMA5942BT3G; MOUSER_PRICE-STOCK: https://www.mouser.co.uk/ProductDetail/ON-Semiconductor/1SMA5942BT3G?qs=y2kkmE52mdPrQGqg%252Bfz9yg%3D%3D